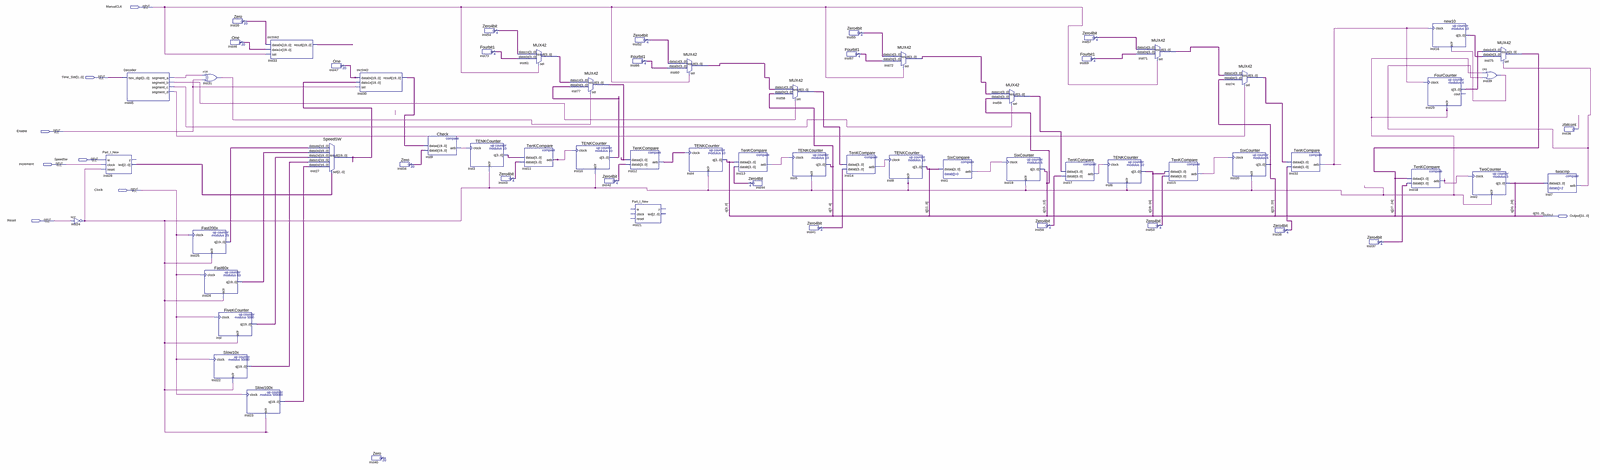
[diagram p0: schematic sheet, whole]
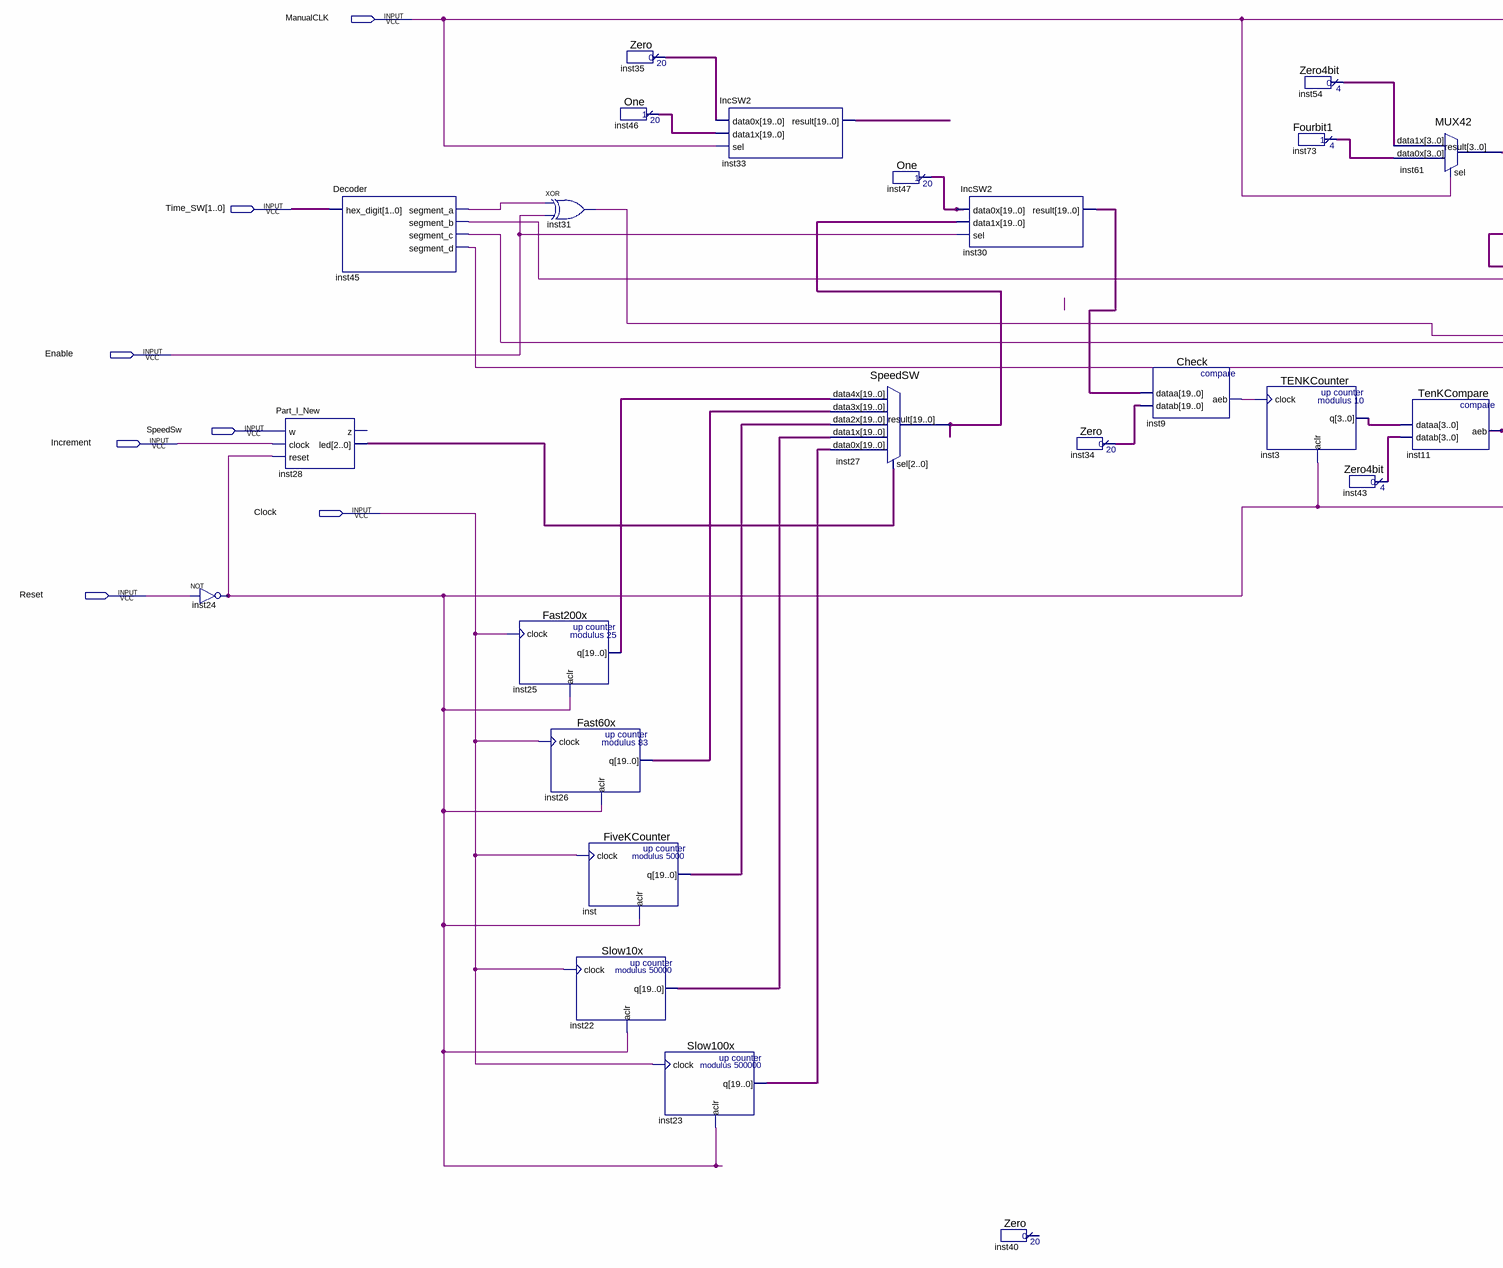
[diagram p1: schematic sheet, left part]
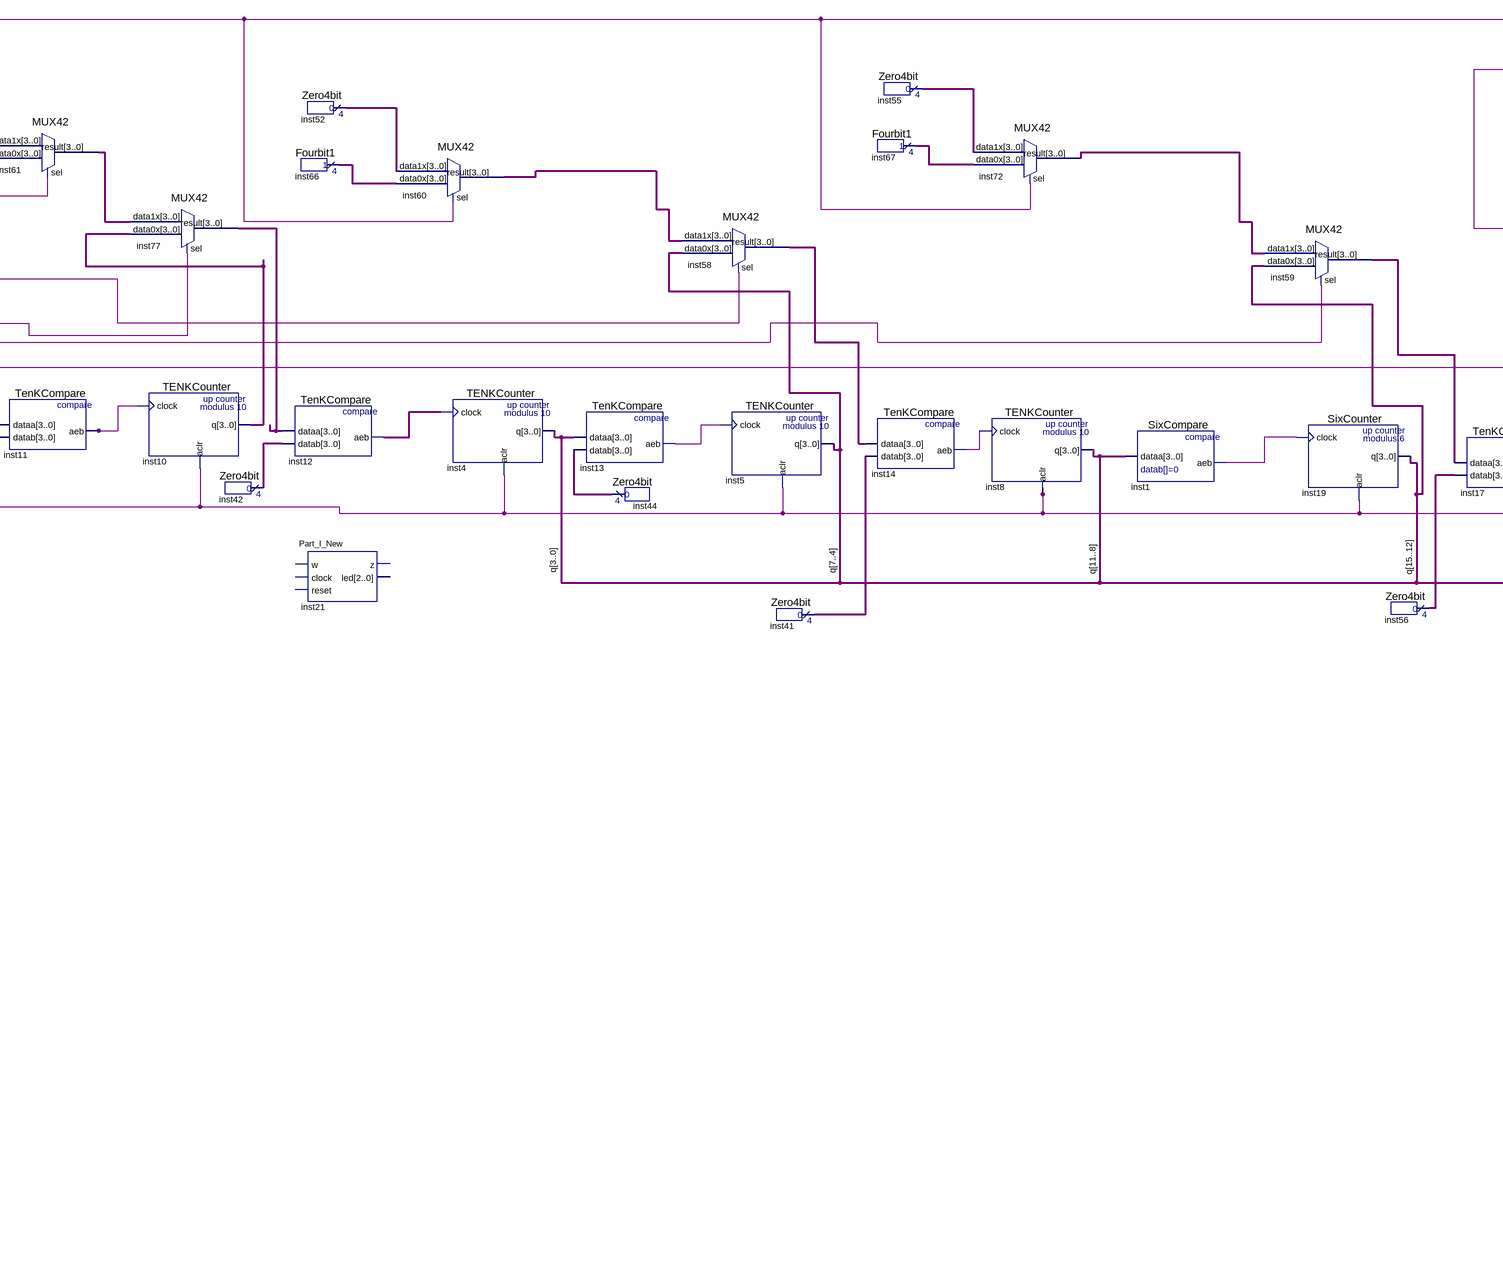
[diagram p2: schematic sheet, centre part]
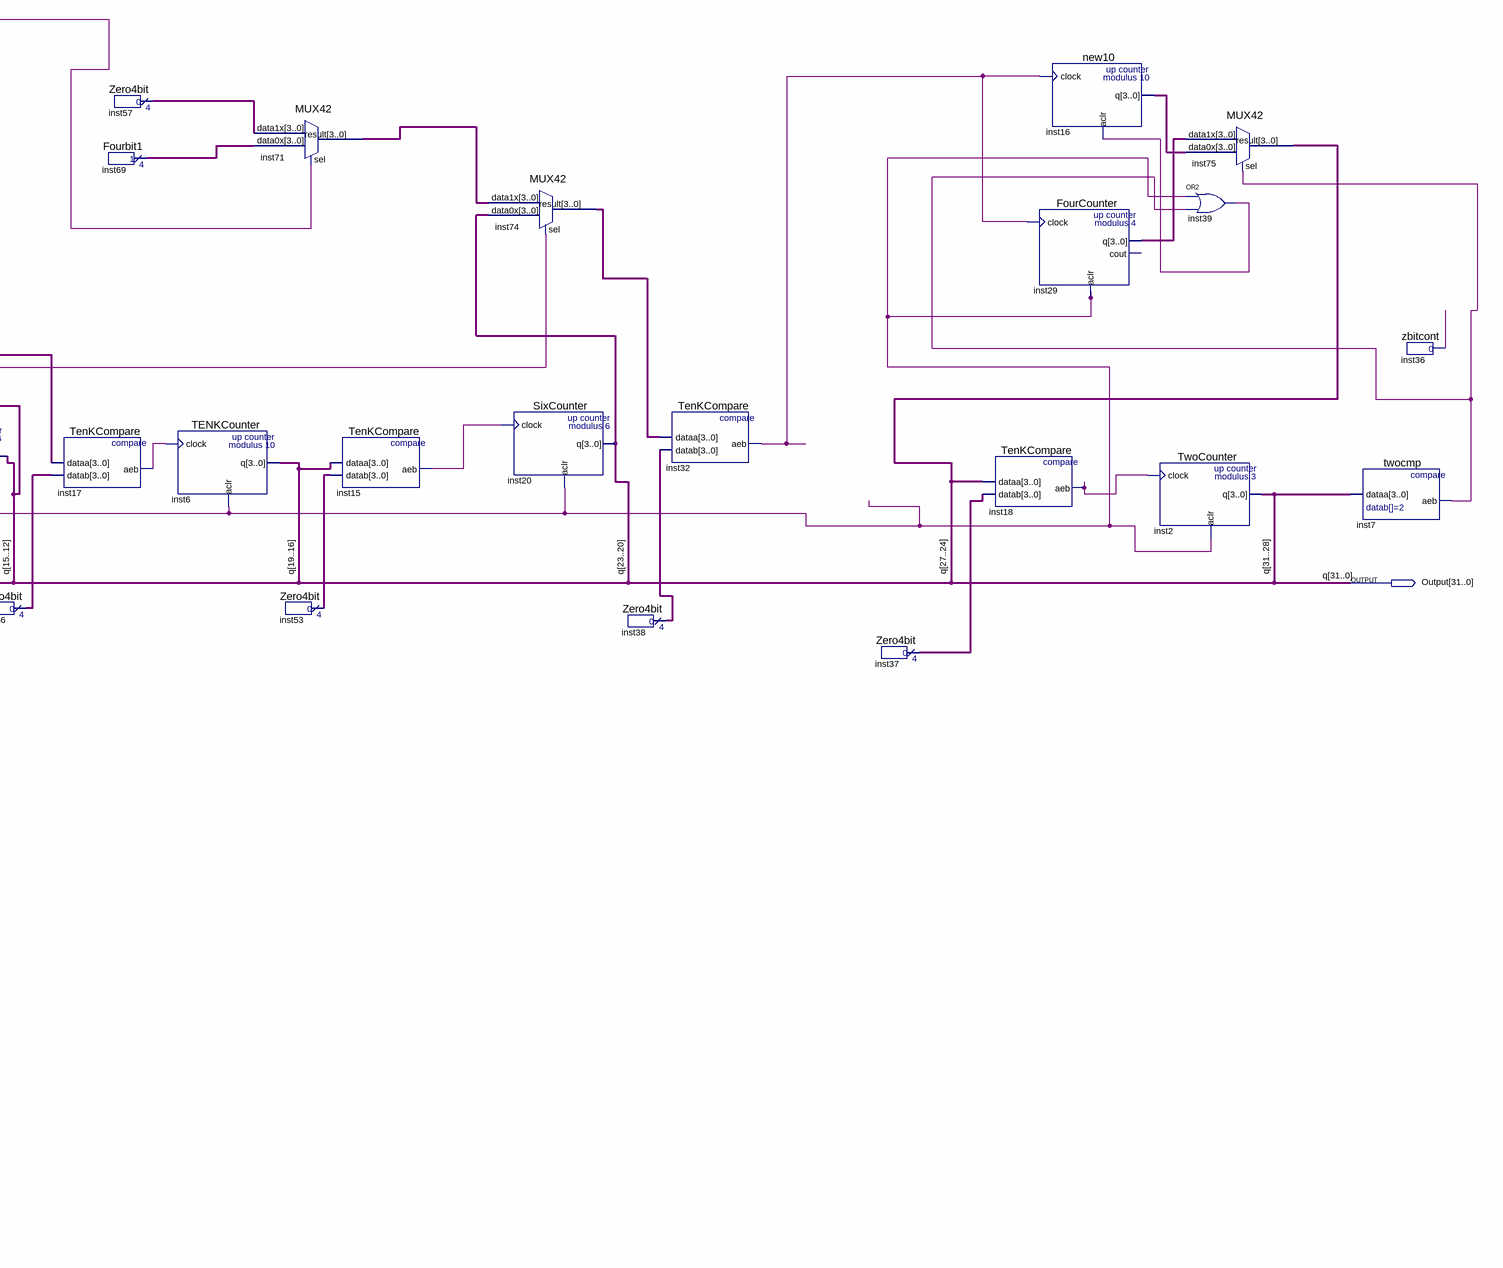
[diagram p3: schematic sheet, right part]
// Quartus schematic Timer.bdf as structural Verilog: 67 symbols, 8 pins
module Timer (
  input  ManualCLK,
  input  [1:0] Time_SW,
  input  Enable,
  input  SpeedSw,
  input  Increment,
  input  Clock,
  input  Reset,
  output [31:0] Output
);

  wire inst1_aeb, inst7_aeb, inst9_aeb, inst11_aeb, inst12_aeb, inst13_aeb, inst14_aeb, inst15_aeb,
       inst17_aeb, inst18_aeb, inst24_out, inst31_out, inst32_aeb, inst36_result, inst39_out,
       inst45_segment_a, inst45_segment_b, inst45_segment_c, inst45_segment_d;
  wire [2:0] inst28_led;
  wire [3:0] inst3_q, inst10_q, inst16_q, inst29_q, inst37_result, inst38_result, inst41_result,
       inst42_result, inst43_result, inst44_result, inst52_result, inst53_result, inst54_result,
       inst55_result, inst56_result, inst57_result, inst58_result, inst59_result, inst60_result,
       inst61_result, inst66_result, inst67_result, inst69_result, inst71_result, inst72_result,
       inst73_result, inst74_result, inst77_result;
  wire [19:0] inst22_q, inst23_q, inst25_q, inst26_q, inst27_result, inst30_result, inst33_result,
       inst34_result, inst35_result, inst46_result, inst47_result, inst_q;

  not inst24 (inst24_out, Reset);
  Part_I_New inst28 (.w(SpeedSw), .clock(Increment), .reset(inst24_out), .led(inst28_led));  // open: z
  Decoder inst45 (
    .hex_digit(Time_SW), .segment_a(inst45_segment_a), .segment_b(inst45_segment_b),
    .segment_c(inst45_segment_c), .segment_d(inst45_segment_d));
  Fast200x inst25 (.clock(Clock), .aclr(inst24_out), .q(inst25_q));
  Fast60x inst26 (.clock(Clock), .aclr(inst24_out), .q(inst26_q));
  xor inst31 (inst31_out, inst45_segment_a, Enable);
  FiveKCounter inst (.clock(Clock), .aclr(inst24_out), .q(inst_q));
  Slow10x inst22 (.clock(Clock), .aclr(inst24_out), .q(inst22_q));
  Zero inst35 (.result(inst35_result));
  One inst46 (.result(inst46_result));
  Slow100x inst23 (.clock(Clock), .aclr(inst24_out), .q(inst23_q));
  IncSW2 inst33 (.data0x(inst35_result), .data1x(inst46_result), .sel(ManualCLK), .result(inst33_result));
  SpeedSW inst27 (
    .data4x(inst25_q), .data3x(inst26_q), .data2x(inst_q), .data1x(inst22_q), .data0x(inst23_q),
    .sel(inst28_led), .result(inst27_result));
  One inst47 (.result(inst47_result));
  IncSW2 inst30 (.data0x(inst47_result), .data1x(inst27_result), .sel(Enable), .result(inst30_result));
  Zero inst40 ();  // open: result
  Zero inst34 (.result(inst34_result));
  Check inst9 (.dataa(inst30_result), .datab(inst34_result), .aeb(inst9_aeb));
  Zero4bit inst54 (.result(inst54_result));
  Fourbit1 inst73 (.result(inst73_result));
  TENKCounter inst3 (.clock(inst9_aeb), .aclr(inst24_out), .q(inst3_q));
  Zero4bit inst43 (.result(inst43_result));
  MUX42 inst61 (.data1x(inst54_result), .data0x(inst73_result), .sel(ManualCLK), .result(inst61_result));
  TenKCompare inst11 (.dataa(inst3_q), .datab(inst43_result), .aeb(inst11_aeb));
  MUX42 inst77 (.data1x(inst61_result), .data0x(inst10_q), .sel(inst31_out), .result(inst77_result));
  TENKCounter inst10 (.clock(inst11_aeb), .aclr(inst24_out), .q(inst10_q));
  Zero4bit inst42 (.result(inst42_result));
  Zero4bit inst52 (.result(inst52_result));
  Fourbit1 inst66 (.result(inst66_result));
  TenKCompare inst12 (.dataa(inst77_result), .datab(inst42_result), .aeb(inst12_aeb));
  Part_I_New inst21 ();  // open: w, clock, reset, z, led
  MUX42 inst60 (.data1x(inst52_result), .data0x(inst66_result), .sel(ManualCLK), .result(inst60_result));
  TENKCounter inst4 (.clock(inst12_aeb), .aclr(inst24_out), .q(Output[3:0]));
  TenKCompare inst13 (.dataa(Output[3:0]), .datab(inst44_result), .aeb(inst13_aeb));
  Zero4bit inst44 (.result(inst44_result));
  MUX42 inst58 (.data1x(inst60_result), .data0x(Output[7:4]), .sel(inst45_segment_b), .result(inst58_result));
  TENKCounter inst5 (.clock(inst13_aeb), .aclr(inst24_out), .q(Output[7:4]));
  Zero4bit inst41 (.result(inst41_result));
  Zero4bit inst55 (.result(inst55_result));
  Fourbit1 inst67 (.result(inst67_result));
  TenKCompare inst14 (.dataa(inst58_result), .datab(inst41_result), .aeb(inst14_aeb));
  MUX42 inst72 (.data1x(inst55_result), .data0x(inst67_result), .sel(ManualCLK), .result(inst72_result));
  TENKCounter inst8 (.clock(inst14_aeb), .aclr(inst24_out), .q(Output[11:8]));
  SixCompare inst1 (.dataa(Output[11:8]), .aeb(inst1_aeb));
  MUX42 inst59 (.data1x(inst72_result), .data0x(Output[15:12]), .sel(inst45_segment_c), .result(inst59_result));
  SixCounter inst19 (.clock(inst1_aeb), .aclr(inst24_out), .q(Output[15:12]));
  Zero4bit inst56 (.result(inst56_result));
  TenKCompare inst17 (.dataa(inst59_result), .datab(inst56_result), .aeb(inst17_aeb));
  Zero4bit inst57 (.result(inst57_result));
  Fourbit1 inst69 (.result(inst69_result));
  TENKCounter inst6 (.clock(inst17_aeb), .aclr(inst24_out), .q(Output[19:16]));
  MUX42 inst71 (.data1x(inst57_result), .data0x(inst69_result), .sel(ManualCLK), .result(inst71_result));
  Zero4bit inst53 (.result(inst53_result));
  TenKCompare inst15 (.dataa(Output[19:16]), .datab(inst53_result), .aeb(inst15_aeb));
  MUX42 inst74 (.data1x(inst71_result), .data0x(Output[23:20]), .sel(inst45_segment_d), .result(inst74_result));
  SixCounter inst20 (.clock(inst15_aeb), .aclr(inst24_out), .q(Output[23:20]));
  Zero4bit inst38 (.result(inst38_result));
  TenKCompare inst32 (.dataa(inst74_result), .datab(inst38_result), .aeb(inst32_aeb));
  Zero4bit inst37 (.result(inst37_result));
  FourCounter inst29 (.clock(inst32_aeb), .aclr(inst24_out), .q(inst29_q));  // open: cout
  TenKCompare inst18 (.dataa(Output[27:24]), .datab(inst37_result), .aeb(inst18_aeb));
  new10 inst16 (.clock(inst32_aeb), .aclr(inst39_out), .q(inst16_q));
  TwoCounter inst2 (.clock(inst18_aeb), .aclr(inst24_out), .q(Output[31:28]));
  MUX42 inst75 (.data1x(inst29_q), .data0x(inst16_q), .sel(inst7_aeb), .result(Output[27:24]));
  or inst39 (inst39_out, inst24_out, inst7_aeb);
  twocmp inst7 (.dataa(Output[31:28]), .aeb(inst7_aeb));
  zbitcont inst36 (.result(inst36_result));

  // Other names for the same wires on the sheet: q[31:0] = Output
endmodule
